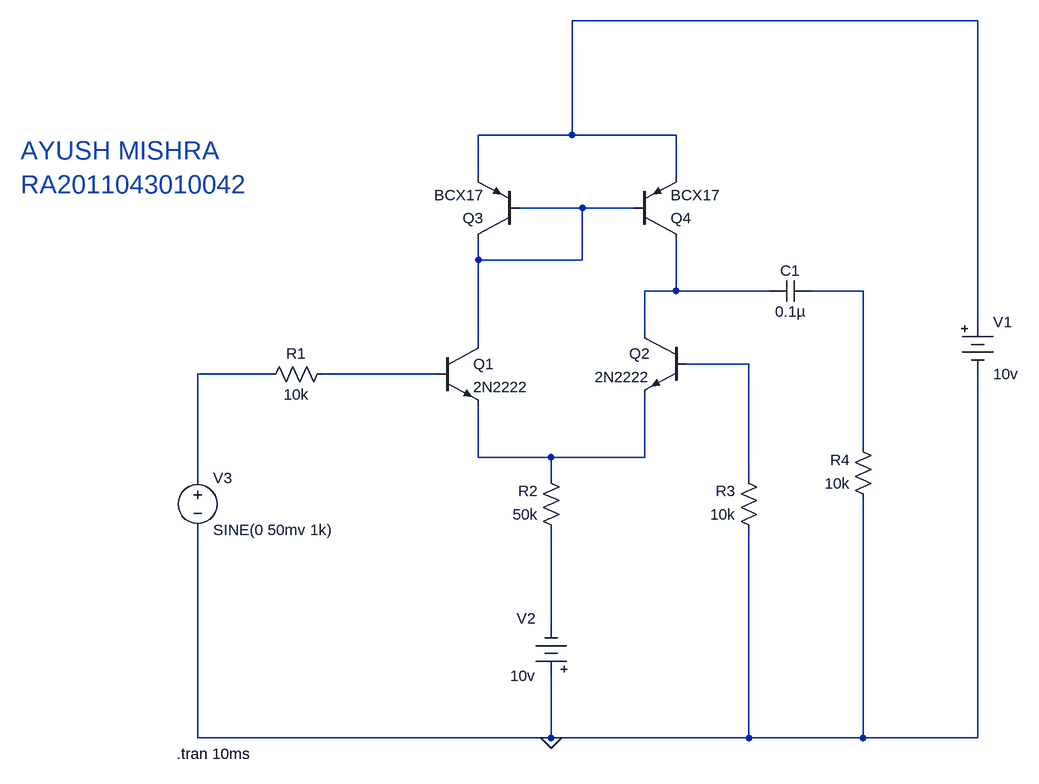
[diagram p0: schematic exp 13a.asc]
exp 13a.asc, the LTspice schematic file:
Version 4
SHEET 1 936 808
WIRE 864 -336 240 -336
WIRE 240 -160 240 -336
WIRE 240 -160 96 -160
WIRE 400 -160 240 -160
WIRE 96 -96 96 -160
WIRE 400 -96 400 -160
WIRE 256 -48 160 -48
WIRE 336 -48 256 -48
WIRE 96 32 96 0
WIRE 256 32 256 -48
WIRE 256 32 96 32
WIRE 400 80 400 0
WIRE 400 80 352 80
WIRE 544 80 400 80
WIRE 688 80 608 80
WIRE 864 128 864 -336
WIRE 352 144 352 80
WIRE 96 160 96 32
WIRE 512 192 416 192
WIRE -224 208 -336 208
WIRE 32 208 -144 208
WIRE 688 320 688 80
WIRE 96 336 96 256
WIRE 208 336 96 336
WIRE 352 336 352 240
WIRE 352 336 208 336
WIRE -336 368 -336 208
WIRE 208 368 208 336
WIRE 512 368 512 192
WIRE 208 592 208 448
WIRE -336 768 -336 448
WIRE 208 768 208 672
WIRE 208 768 -336 768
WIRE 512 768 512 448
WIRE 512 768 208 768
WIRE 688 768 688 400
WIRE 688 768 512 768
WIRE 864 768 864 208
WIRE 864 768 688 768
FLAG 208 768 0
SYMBOL npn 32 160 R0
SYMATTR InstName Q1
SYMATTR Value 2N2222
SYMBOL pnp 160 0 R180
SYMATTR InstName Q3
SYMATTR Value BCX17
SYMBOL pnp 336 0 M180
SYMATTR InstName Q4
SYMATTR Value BCX17
SYMBOL npn 416 144 M0
SYMATTR InstName Q2
SYMATTR Value 2N2222
SYMBOL res -128 192 R90
WINDOW 0 0 56 VBottom 2
WINDOW 3 32 56 VTop 2
SYMATTR InstName R1
SYMATTR Value 10k
SYMBOL res 224 464 R180
WINDOW 0 36 76 Left 2
WINDOW 3 36 40 Left 2
SYMATTR InstName R2
SYMATTR Value 50k
SYMBOL res 528 464 R180
WINDOW 0 36 76 Left 2
WINDOW 3 36 40 Left 2
SYMATTR InstName R3
SYMATTR Value 10k
SYMBOL res 704 416 R180
WINDOW 0 36 76 Left 2
WINDOW 3 36 40 Left 2
SYMATTR InstName R4
SYMATTR Value 10k
SYMBOL cap 608 64 R90
WINDOW 0 0 32 VBottom 2
WINDOW 3 32 32 VTop 2
SYMATTR InstName C1
SYMATTR Value 0.1µ
SYMBOL Misc\\battery 864 112 R0
WINDOW 123 0 0 Left 0
WINDOW 39 0 0 Left 0
SYMATTR InstName V1
SYMATTR Value 10v
SYMBOL Misc\\battery 208 688 R180
WINDOW 0 24 104 Left 2
WINDOW 3 24 16 Left 2
WINDOW 123 0 0 Left 0
WINDOW 39 0 0 Left 0
SYMATTR InstName V2
SYMATTR Value 10v
SYMBOL voltage -336 352 R0
WINDOW 123 0 0 Left 0
WINDOW 39 0 0 Left 0
SYMATTR InstName V3
SYMATTR Value SINE(0 50mv 1k)
TEXT -368 792 Left 2 !.tran 10ms
TEXT -608 -136 Left 4 ;AYUSH MISHRA\nRA2011043010042

The netlist it stands for:
* exp 13a.asc
Q1 N002 N007 N008 0 2N2222
Q3 N002 N002 N001 0 BCX17
Q4 N003 N002 N001 0 BCX17
Q2 N003 N005 N008 0 2N2222
R1 N007 N006 10k
R2 N009 N008 50k
R3 0 N005 10k
R4 0 N004 10k
C1 N004 N003 0.1µ
V1 N001 0 10v
V2 0 N009 10v
V3 N006 0 SINE(0 50mv 1k)
.model NPN NPN
.model PNP PNP
.lib standard.bjt
.tran 10ms
* AYUSH MISHRA
* RA2011043010042
.backanno
.end